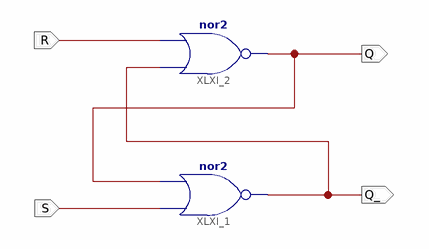
[diagram p0: schematic sheet 1]
// Xilinx ISE schematic SR_Latch_nor.sch (kintex7) as structural Verilog: 2 symbols, 4 ports
module SR_Latch_nor (
  input  R,
  input  S,
  output Q_,
  output Q
);

  nor XLXI_1 (Q_, S, Q);
  nor XLXI_2 (Q, Q_, R);
endmodule
